# Altium project Power_Control_V6.2.PrjPcb
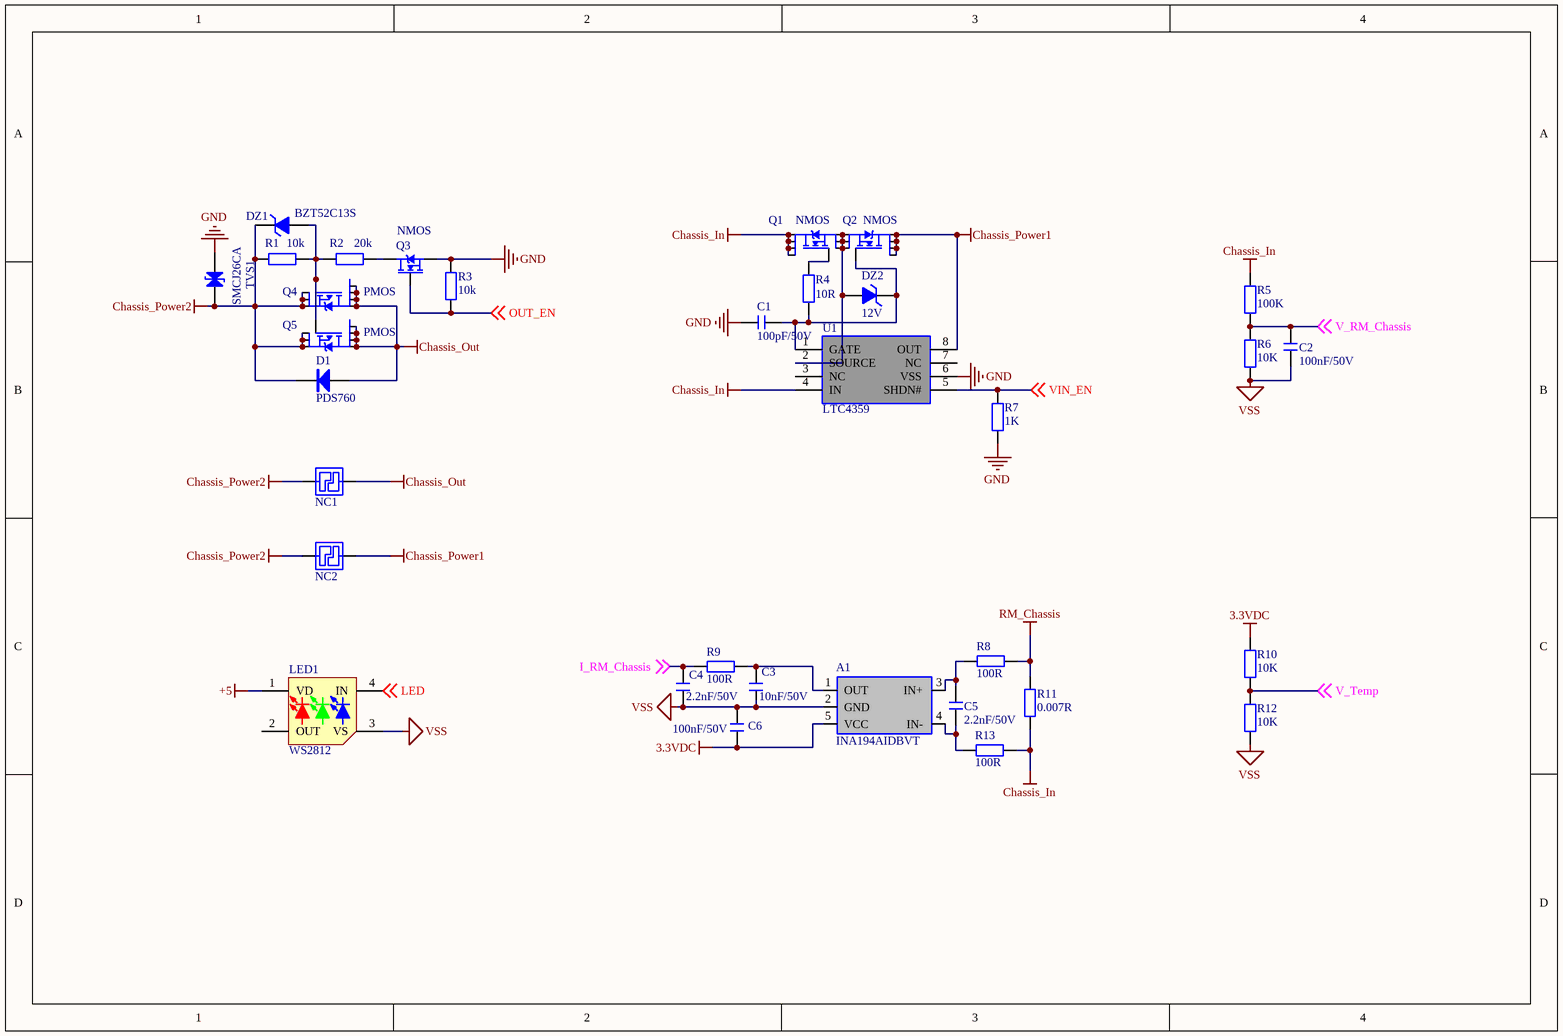
[diagram p0: Function.SchDoc]
5 sheets, 299 parts. Net scope: global (net labels, ports and power ports of the same name join across sheets).
Board file: Power_Control.PcbDoc
Sheets:
  Function.SchDoc
  EDLC_DC_DC.SchDoc
  Port.SchDoc
  Power.SchDoc
  STM32G474R.SchDoc

## Sheet Function.SchDoc
size A4; SheetNumber: 1; SheetTotal: 5

### Parts
(Parts that share a designator on the sheet are numbered #1, #2 ... from top to bottom, then left to right.)
A1  INA194AIDBVT  [SOT23-5]
C1  100pF/50V  [C 0603_L]
C2  100nF/50V  [C 0603_L]
C3  10nF/50V  [C 0603_L]
C4  2.2nF/50V  [C 0603_L]
C5  2.2nF/50V  [C 0603_L]
C6  100nF/50V  [C 0603_L]
D1#1  PDS760  [SMPC]
DZ1  BZT52C13S  [SOD-323]
DZ2  12V  [SOD-323]
LED1  WS2812  [LED 3528-RGB]
NC1  NODE  [NODE-2]  (value not drawn)
NC2  NODE  [NODE-3]  (value not drawn)
Q1  NMOS  [DFN5*6-8L]
Q2  NMOS  [DFN5*6-8L]
Q3  NMOS  [SOT23-3L]
Q4  PMOS  [DFN5*6-8L]
Q5  PMOS  [DFN5*6-8L]
R1  10k  [R 0603_L]
R2  20k  [R 0603_L]
R3  10k  [R 0603_L]
R4  10R  [R 0603_L]
R5  100K  [R 0603_L]
R6  10K  [R 0603_L]
R7  1K  [R 0603_L]
R8  100R  [R 0603_L]
R9  100R  [R 0603_L]
R10  10K  [R 0603_L]
R11  0.007R  [R 2512_M]
R12  10K  [R 0603_L]
R13  100R  [R 0603_L]
TVS1#1  SMCJ26CA  [SMC]
U1  LTC4359  [MSOP8_L]

### Nets
3.3VDC: A1.5(VCC) C6.2 R10.1
+5: LED1.1(VD)
Chassis_In: Q1.5(D) Q1.6(D) Q1.7(D) Q1.8(D) R5.1 R11.2 R13.2 U1.4(IN)
Chassis_Out: D1#1.1(A) NC1.2 Q4.5(D) Q4.6(D) Q4.7(D) Q4.8(D) Q5.5(D) Q5.6(D) Q5.7(D) Q5.8(D)
Chassis_Power1: NC2.2 Q2.5(D) Q2.6(D) Q2.7(D) Q2.8(D) U1.8(OUT)
Chassis_Power2: D1#1.2(K) DZ1.2(K) NC1.1 NC2.1 Q4.1(S) Q4.2(S) Q4.3(S) Q5.1(S) Q5.2(S) Q5.3(S) R1.2 TVS1#1.2(K)
GND: C1.2 Q3.3(S) R3.1 R7.1 TVS1#1.1(A) U1.6(VSS)
RM_Chassis: R8.2 R11.1
VSS: A1.2(GND) C2.1 C3.2 C4.2 C6.1 LED1.3(VS) R6.2 R12.2
I_RM_Chassis: C4.1 R9.2 ; off-sheet I_RM_Chassis  [project net A07_P21]
LED: LED1.4(IN) ; off-sheet LED  [project net B09_P62]
OUT_EN: Q3.1(G) R3.2 ; off-sheet OUT_EN  [project net B11_P33]
V_RM_Chassis: C2.2 R5.2 R6.1 ; off-sheet V_RM_Chassis  [project net A06_P20]
V_Temp: R10.2 R12.1 ; off-sheet V_Temp  [project net B12_P34]
VIN_EN: R7.2 U1.5(SHDN#) ; off-sheet VIN_EN  [project net A15_P51]
NetA1_1: A1.1(OUT) C3.1 R9.1
NetA1_3: A1.3(IN+) C5.1 R8.1
NetA1_4: A1.4(IN-) C5.2 R13.1
NetC1_1: C1.1 DZ2.2(K) Q2.4(G) R4.1 U1.1(GATE)
NetDZ1_1: DZ1.1(A) Q4.4(G) Q5.4(G) R1.1 R2.1
NetDZ2_1: DZ2.1(A) Q1.1(S) Q1.2(S) Q1.3(S) Q2.1(S) Q2.2(S) Q2.3(S) U1.2(SOURCE)
NetQ1_4: Q1.4(G) R4.2
NetQ3_2: Q3.2(D) R2.2

Not connected (* = marked no-connect by the designer): LED1 2(OUT); U1 3(NC) 7(NC)

### Library data of the parts
A1 = INA194AIDBVT: 电流感应放大器 80V
C1-C6 = C: 无极性贴片电容; 版权归属: 源创客; BOM名称: 无极性贴片电容; 学习资源: www.ooocke.com
D1#1 = SS76: 肖特基二极管; 版权归属: 源创客; BOM名称: 肖特基二极管; 学习资源: www.ooocke.com
DZ1 DZ2 = CVD: 稳压二极管
LED1 = WS2812: 全彩可控LED; pin to pad: 1>2 2>1 3>4 4>3
NC1 NC2 = NODE: 大电流节点
Q1 Q2 = NMOS_DFN: DFN封装N沟道场效应管; BOM名称: P沟道场效应管; 版权归属: 源创客; 学习资源: www.ooocke.com
Q3 = NMOS_SS: 贴片信号N沟道场效应管; pin to pad: 2>3 3>2; 版权归属: 源创客; BOM名称: N沟道场效应管; 学习资源: www.ooocke.com
Q4 Q5 = PMOS_DFN: DFN封装P沟道场效应管; 版权归属: 源创客; BOM名称: P沟道场效应管; 学习资源: www.ooocke.com
R1-R9 R11-R13 = R: 贴片电阻; 版权归属: 源创客; BOM名称: 贴片电阻; 学习资源: www.ooocke.com
R10 = R: NTC热敏电阻; BOM名称: 贴片电阻; 版权归属: 源创客; 学习资源: www.ooocke.com
TVS1#1 = TVS: 瞬态电压抑制二极管; 版权归属: 源创客; BOM名称: 瞬态电压抑制二极管; 学习资源: www.ooocke.com
U1 = LTC4359: 理想二极管控制器

## Sheet EDLC_DC_DC.SchDoc
size A3; SheetNumber: 2; SheetTotal: 5
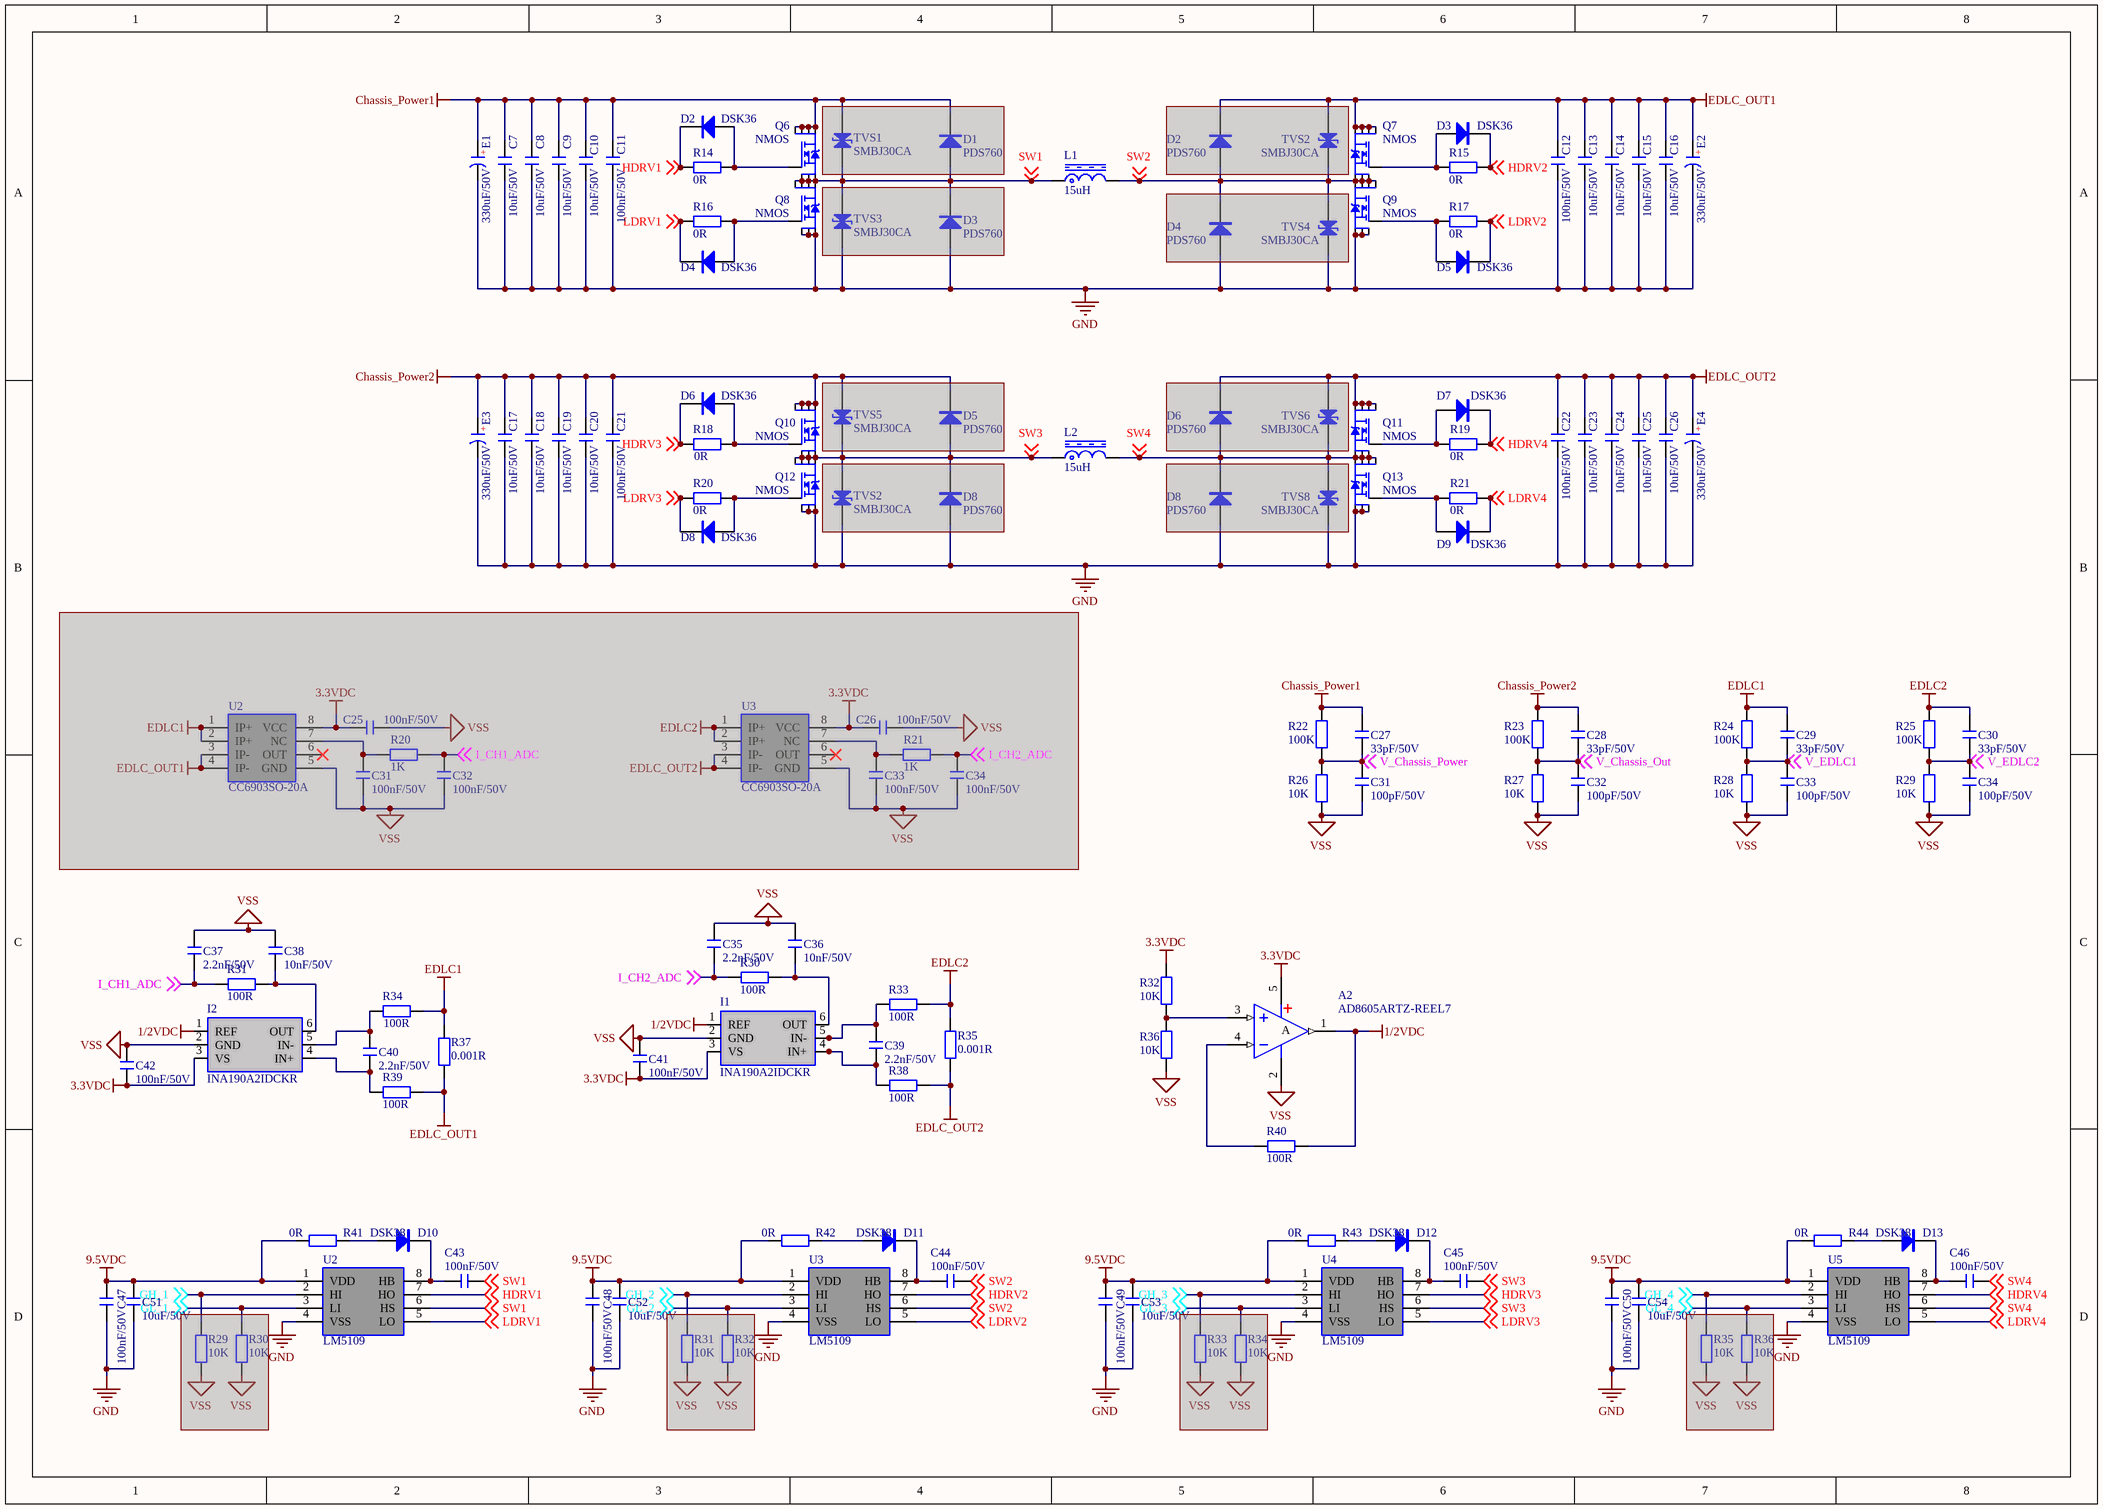
[diagram p1: EDLC_DC_DC.SchDoc]

### Parts
(Parts that share a designator on the sheet are numbered #1, #2 ... from top to bottom, then left to right.)
A2  AD8605ARTZ-REEL7  [SOT23-5N]
C7  10uF/50V  [C 1206_L]
C8  10uF/50V  [C 1206_L]
C9  10uF/50V  [C 1206_L]
C10  10uF/50V  [C 1206_L]
C11  100nF/50V  [C 0603_L]
C12  100nF/50V  [C 0603_L]
C13  10uF/50V  [C 1206_L]
C14  10uF/50V  [C 1206_L]
C15  10uF/50V  [C 1206_L]
C16  10uF/50V  [C 1206_L]
C17  10uF/50V  [C 1206_L]
C18  10uF/50V  [C 1206_L]
C19  10uF/50V  [C 1206_L]
C20  10uF/50V  [C 1206_L]
C21  100nF/50V  [C 0603_L]
C22  100nF/50V  [C 0603_L]
C23  10uF/50V  [C 1206_L]
C24  10uF/50V  [C 1206_L]
C25#1  10uF/50V  [C 1206_L]
C25#2  100nF/50V  [C 0603_L]  (masked out: inside a compile mask, not in the netlist)
C26#1  10uF/50V  [C 1206_L]
C26#2  100nF/50V  [C 0603_L]  (masked out: inside a compile mask, not in the netlist)
C27  33pF/50V  [C 0603_L]
C28  33pF/50V  [C 0603_L]
C29  33pF/50V  [C 0603_L]
C30  33pF/50V  [C 0603_L]
C31#1  100nF/50V  [C 0603_L]  (masked out: inside a compile mask, not in the netlist)
C31#2  100pF/50V  [C 0603_L]
C32#1  100nF/50V  [C 0603_L]  (masked out: inside a compile mask, not in the netlist)
C32#2  100pF/50V  [C 0603_L]
C33#1  100nF/50V  [C 0603_L]  (masked out: inside a compile mask, not in the netlist)
C33#2  100pF/50V  [C 0603_L]
C34#1  100nF/50V  [C 0603_L]  (masked out: inside a compile mask, not in the netlist)
C34#2  100pF/50V  [C 0603_L]
C35  2.2nF/50V  [C 0603_L]
C36  10nF/50V  [C 0603_L]
C37  2.2nF/50V  [C 0603_L]
C38  10nF/50V  [C 0603_L]
C39  2.2nF/50V  [C 0603_L]
C40  2.2nF/50V  [C 0603_L]
C41  100nF/50V  [C 0603_L]
C42  100nF/50V  [C 0603_L]
C43  100nF/50V  [C 0603_L]
C44#1  100nF/50V  [C 0603_L]
C45  100nF/50V  [C 0603_L]
C46  100nF/50V  [C 0603_L]
C47  100nF/50V  [C 0603_L]
C48  100nF/50V  [C 0603_L]
C49  100nF/50V  [C 0603_L]
C50  100nF/50V  [C 0603_L]
C51  10uF/50V  [C 1206_L]
C52  10uF/50V  [C 1206_L]
C53  10uF/50V  [C 1206_L]
C54  10uF/50V  [C 1206_L]
D1#2  PDS760  [SMPC]  (masked out: inside a compile mask, not in the netlist)
D2#1  DSK36  [SOD-323]
D2#2  PDS760  [SMPC]  (masked out: inside a compile mask, not in the netlist)
D3#1  DSK36  [SOD-323]
D3#2  PDS760  [SMPC]  (masked out: inside a compile mask, not in the netlist)
D4#1  PDS760  [SMPC]  (masked out: inside a compile mask, not in the netlist)
D4#2  DSK36  [SOD-323]
D5#1  DSK36  [SOD-323]
D5#2  PDS760  [SMPC]  (masked out: inside a compile mask, not in the netlist)
D6#1  DSK36  [SOD-323]
D6#2  PDS760  [SMPC]  (masked out: inside a compile mask, not in the netlist)
D7  DSK36  [SOD-323]
D8#1  PDS760  [SMPC]  (masked out: inside a compile mask, not in the netlist)
D8#2  PDS760  [SMPC]  (masked out: inside a compile mask, not in the netlist)
D8#3  DSK36  [SOD-323]
D9  DSK36  [SOD-323]
D10  DSK38  [SOD-123F]
D11  DSK38  [SOD-123F]
D12  DSK38  [SOD-123F]
D13  DSK38  [SOD-123F]
E1  330uF/50V  [CS 5.0*10*13 - R]
E2  330uF/50V  [CS 5.0*10*13 - R]
E3  330uF/50V  [CS 5.0*10*13 - R]
E4  330uF/50V  [CS 5.0*10*13 - R]
I1  INA190A2IDCKR  [SC-70-6]
I2  INA190A2IDCKR  [SC-70-6]
L1  15uH  [CKST2020-1717]
L2  15uH  [CKST2020-1717]
Q6  NMOS  [DFN5*6-8L]
Q7  NMOS  [DFN5*6-8L]
Q8  NMOS  [DFN5*6-8L]
Q9  NMOS  [DFN5*6-8L]
Q10  NMOS  [DFN5*6-8L]
Q11  NMOS  [DFN5*6-8L]
Q12  NMOS  [DFN5*6-8L]
Q13  NMOS  [DFN5*6-8L]
R14  0R  [R 0603_L]
R15  0R  [R 0603_L]
R16  0R  [R 0603_L]
R17  0R  [R 0603_L]
R18  0R  [R 0603_L]
R19  0R  [R 0603_L]
R20#1  0R  [R 0603_L]
R20#2  1K  [R 0603_L]  (masked out: inside a compile mask, not in the netlist)
R21#1  0R  [R 0603_L]
R21#2  1K  [R 0603_L]  (masked out: inside a compile mask, not in the netlist)
R22  100K  [R 0603-HP_L]
R23  100K  [R 0603-HP_L]
R24  100K  [R 0603-HP_L]
R25  100K  [R 0603-HP_L]
R26  10K  [R 0603-HP_L]
R27  10K  [R 0603-HP_L]
R28  10K  [R 0603-HP_L]
R29#1  10K  [R 0603-HP_L]
R29#2  10K  [R 0603_L]  (masked out: inside a compile mask, not in the netlist)
R30#1  100R  [R 0603_L]
R30#2  10K  [R 0603_L]  (masked out: inside a compile mask, not in the netlist)
R31#1  100R  [R 0603_L]
R31#2  10K  [R 0603_L]  (masked out: inside a compile mask, not in the netlist)
R32#1  10K  [R 0603-HP_L]
R32#2  10K  [R 0603_L]  (masked out: inside a compile mask, not in the netlist)
R33#1  100R  [R 0603_L]
R33#2  10K  [R 0603_L]  (masked out: inside a compile mask, not in the netlist)
R34#1  100R  [R 0603_L]
R34#2  10K  [R 0603_L]  (masked out: inside a compile mask, not in the netlist)
R35#1  0.001R  [R 2512_M]
R35#2  10K  [R 0603_L]  (masked out: inside a compile mask, not in the netlist)
R36#1  10K  [R 0603-HP_L]
R36#2  10K  [R 0603_L]  (masked out: inside a compile mask, not in the netlist)
R37  0.001R  [R 2512_M]
R38  100R  [R 0603_L]
R39  100R  [R 0603_L]
R40  100R  [R 0603_L]
R41  0R  [R 0603_L]
R42  0R  [R 0603_L]
R43  0R  [R 0603_L]
R44#1  0R  [R 0603_L]
TVS1#2  SMBJ30CA  [SMB]  (masked out: inside a compile mask, not in the netlist)
TVS2#1  SMBJ30CA  [SMB]  (masked out: inside a compile mask, not in the netlist)
TVS2#2  SMBJ30CA  [SMB]  (masked out: inside a compile mask, not in the netlist)
TVS3#1  SMBJ30CA  [SMB]  (masked out: inside a compile mask, not in the netlist)
TVS4#1  SMBJ30CA  [SMB]  (masked out: inside a compile mask, not in the netlist)
TVS5  SMBJ30CA  [SMB]  (masked out: inside a compile mask, not in the netlist)
TVS6  SMBJ30CA  [SMB]  (masked out: inside a compile mask, not in the netlist)
TVS8  SMBJ30CA  [SMB]  (masked out: inside a compile mask, not in the netlist)
U2#1  CC6903SO-20A  [SOP8_L]  (masked out: inside a compile mask, not in the netlist)
U2#2  LM5109  [SOP8_L]
U3#1  CC6903SO-20A  [SOP8_L]  (masked out: inside a compile mask, not in the netlist)
U3#2  LM5109  [SOP8_L]
U4  LM5109  [SOP8_L]
U5  LM5109  [SOP8_L]

### Nets
1/2VDC: A2.1(OUT) I1.1(REF) I2.1(REF) R40.2
3.3VDC: A2.5(V+) C41.2 C42.2 I1.3(VS) I2.3(VS) R32#1.2
9.5VDC: C47.2 C48.2 C49.2 C50.2 C51.2 C52.2 C53.2 C54.2 R41.1 R42.1 R43.1 R44#1.1 U2#2.1(VDD) U3#2.1(VDD) U4.1(VDD) U5.1(VDD)
Chassis_Power1: C7.1 C8.1 C9.1 C10.1 C11.1 C27.1 E1.1(A) Q6.5(D) Q6.6(D) Q6.7(D) Q6.8(D) R22.2
Chassis_Power2: C17.1 C18.1 C19.1 C20.1 C21.1 C28.1 E3.1(A) Q10.5(D) Q10.6(D) Q10.7(D) Q10.8(D) R23.2
EDLC1: C29.1 R24.2 R34#1.2 R37.1
EDLC2: C30.1 R25.2 R33#1.2 R35#1.1
EDLC_OUT1: C12.1 C13.1 C14.1 C15.1 C16.1 E2.1(A) Q7.5(D) Q7.6(D) Q7.7(D) Q7.8(D) R37.2 R39.2
EDLC_OUT2: C22.1 C23.1 C24.1 C25#1.1 C26#1.1 E4.1(A) Q11.5(D) Q11.6(D) Q11.7(D) Q11.8(D) R35#1.2 R38.2
GND: C7.2 C8.2 C9.2 C10.2 C11.2 C12.2 C13.2 C14.2 C15.2 C16.2 C17.2 C18.2 C19.2 C20.2 C21.2 C22.2 C23.2 C24.2 C25#1.2 C26#1.2 C47.1 C48.1 C49.1 C50.1 C51.1 C52.1 C53.1 C54.1 E1.2(K) E2.2(K) E3.2(K) E4.2(K) Q8.1(S) Q8.2(S) Q8.3(S) Q9.1(S) Q9.2(S) Q9.3(S) Q12.1(S) Q12.2(S) Q12.3(S) Q13.1(S) Q13.2(S) Q13.3(S) U2#2.4(VSS) U3#2.4(VSS) U4.4(VSS) U5.4(VSS)
VSS: A2.2(V-) C31#2.2 C32#2.2 C33#2.2 C34#2.2 C35.2 C36.2 C37.2 C38.2 C41.1 C42.1 I1.2(GND) I2.2(GND) R26.1 R27.1 R28.1 R29#1.1 R36#1.1
GH_1: U2#2.2(HI) ; off-sheet GH_1  [project net C09_P41]
GH_2: U3#2.2(HI) ; off-sheet GH_2  [project net A09_P43]
GH_3: U4.2(HI) ; off-sheet GH_3  [project net C07_P39]
GH_4: U5.2(HI) ; off-sheet GH_4  [project net B15_P37]
GL_1: U2#2.3(LI) ; off-sheet GL_1  [project net C08_P40]
GL_2: U3#2.3(LI) ; off-sheet GL_2  [project net A08_P42]
GL_3: U4.3(LI) ; off-sheet GL_3  [project net C06_P38]
GL_4: U5.3(LI) ; off-sheet GL_4  [project net B14_P36]
HDRV1: D2#1.2(K) R14.1 U2#2.7(HO) ; off-sheet HDRV1
HDRV2: D3#1.2(K) R15.2 U3#2.7(HO) ; off-sheet HDRV2
HDRV3: D6#1.2(K) R18.1 U4.7(HO) ; off-sheet HDRV3
HDRV4: D7.2(K) R19.2 U5.7(HO) ; off-sheet HDRV4
I_CH1_ADC: C37.1 R31#1.2 ; off-sheet I_CH1_ADC  [project net B01_P25]
I_CH2_ADC: C35.1 R30#1.2 ; off-sheet I_CH2_ADC  [project net B00_P24]
LDRV1: D4#2.2(K) R16.1 U2#2.5(LO) ; off-sheet LDRV1
LDRV2: D5#1.2(K) R17.2 U3#2.5(LO) ; off-sheet LDRV2
LDRV3: D8#3.2(K) R20#1.1 U4.5(LO) ; off-sheet LDRV3
LDRV4: D9.2(K) R21#1.2 U5.5(LO) ; off-sheet LDRV4
SW1: C43.2 L1.1 Q6.1(S) Q6.2(S) Q6.3(S) Q8.5(D) Q8.6(D) Q8.7(D) Q8.8(D) U2#2.6(HS) ; off-sheet SW1
SW2: C44#1.2 L1.2 Q7.1(S) Q7.2(S) Q7.3(S) Q9.5(D) Q9.6(D) Q9.7(D) Q9.8(D) U3#2.6(HS) ; off-sheet SW2
SW3: C45.2 L2.1 Q10.1(S) Q10.2(S) Q10.3(S) Q12.5(D) Q12.6(D) Q12.7(D) Q12.8(D) U4.6(HS) ; off-sheet SW3
SW4: C46.2 L2.2 Q11.1(S) Q11.2(S) Q11.3(S) Q13.5(D) Q13.6(D) Q13.7(D) Q13.8(D) U5.6(HS) ; off-sheet SW4
V_Chassis_Out: C28.2 C32#2.1 R23.1 R27.2 ; off-sheet V_Chassis_Out  [project net A00_P12]
V_Chassis_Power: C27.2 C31#2.1 R22.1 R26.2 ; off-sheet V_Chassis_Power  [project net C03_P11]
V_EDLC1: C29.2 C33#2.1 R24.1 R28.2 ; off-sheet V_EDLC1  [project net C02_P10]
V_EDLC2: C30.2 C34#2.1 R25.1 R29#1.2 ; off-sheet V_EDLC2  [project net A01_P13]
NetA2_3: A2.3(IN+) R32#1.1 R36#1.2
NetA2_4: A2.4(IN-) R40.1
NetC36_1: C36.1 I1.6(OUT) R30#1.1
NetC38_1: C38.1 I2.6(OUT) R31#1.1
NetC39_1: C39.1 I1.5(IN-) R33#1.1
NetC39_2: C39.2 I1.4(IN+) R38.1
NetC40_1: C40.1 I2.5(IN-) R34#1.1
NetC40_2: C40.2 I2.4(IN+) R39.1
NetC43_1: C43.1 D10.2(K) U2#2.8(HB)
NetC44#1_1: C44#1.1 D11.2(K) U3#2.8(HB)
NetC45_1: C45.1 D12.2(K) U4.8(HB)
NetC46_1: C46.1 D13.2(K) U5.8(HB)
NetD2#1_1: D2#1.1(A) Q6.4(G) R14.2
NetD3#1_1: D3#1.1(A) Q7.4(G) R15.1
NetD4#2_1: D4#2.1(A) Q8.4(G) R16.2
NetD5#1_1: D5#1.1(A) Q9.4(G) R17.1
NetD6#1_1: D6#1.1(A) Q10.4(G) R18.2
NetD7_1: D7.1(A) Q11.4(G) R19.1
NetD8#3_1: D8#3.1(A) Q12.4(G) R20#1.2
NetD9_1: D9.1(A) Q13.4(G) R21#1.1
NetD10_1: D10.1(A) R41.2
NetD11_1: D11.1(A) R42.2
NetD12_1: D12.1(A) R43.2
NetD13_1: D13.1(A) R44#1.2

### Notes on the sheet
- (in symbol AD8605ARTZ-REEL7) A
- (in symbol C-CS) +

### Library data of the parts
A2 = AD8605ARTZ-REEL7: 高精度低噪声CMOS轨对轨输入/输出运算放大器
C7-C24 C25#1 C25#2 C26#1 C26#2 C27-C30 C31#1 C31#2 C32#1 C32#2 C33#1 C33#2 C34#1 C34#2 C35-C43 C44#1 C45-C54 = C: 无极性贴片电容; 版权归属: 源创客; BOM名称: 无极性贴片电容; 学习资源: www.ooocke.com
D1#2 D2#2 D3#2 D4#1 D5#2 D6#2 D8#1 D8#2 = SS76: 肖特基二极管; 版权归属: 源创客; BOM名称: 肖特基二极管; 学习资源: www.ooocke.com
D2#1 D3#1 D4#2 D5#1 D6#1 D7 D8#3 D9 = 1N4148: 高速开关二极管; 版权归属: 源创客; BOM名称: 高速开关二极管; 学习资源: www.ooocke.com
D10-D13 = SS34: 肖特基二极管; 版权归属: 源创客; 属性: 40V/3A; BOM名称: 肖特基二极管; 学习资源: www.ooocke.com
E1-E4 = C-CS: 直插固态电容; 版权归属: 源创客; BOM名称: 直插固态电容; 学习资源: www.ooocke.com
I1 I2 = INA190A2IDCKR: 电流感应放大器 40V
L1 L2 = L-HP: 一体成型电感; BOM名称: 功率屏蔽电感; 版权归属: 源创客; 学习资源: www.ooocke.com
Q6-Q13 = NMOS_DFN: DFN封装N沟道场效应管; BOM名称: P沟道场效应管; 版权归属: 源创客; 学习资源: www.ooocke.com
R14-R19 R20#1 R20#2 R21#1 R21#2 R29#2 R30#1 R30#2 R31#1 R31#2 R32#2 R33#1 R33#2 R34#1 R34#2 R35#1 R35#2 R36#2 R37-R43 R44#1 = R: 贴片电阻; 版权归属: 源创客; BOM名称: 贴片电阻; 学习资源: www.ooocke.com
R22-R28 R29#1 R32#1 R36#1 = R-Precision: 精密贴片电阻; BOM名称: 精密电阻; 版权归属: 源创客; 学习资源: www.ooocke.com
TVS1#2 TVS2#1 TVS2#2 TVS3#1 TVS4#1 TVS5 TVS6 TVS8 = TVS: 瞬态电压抑制二极管; 版权归属: 源创客; BOM名称: 瞬态电压抑制二极管; 学习资源: www.ooocke.com
U2#1 U3#1 = CC6903: 10A/20A/30A霍尔电流传感器
U2#2 U3#2 U4 U5 = LM5109: 半桥驱动

## Sheet Port.SchDoc
size A4; SheetNumber: 3; SheetTotal: 5
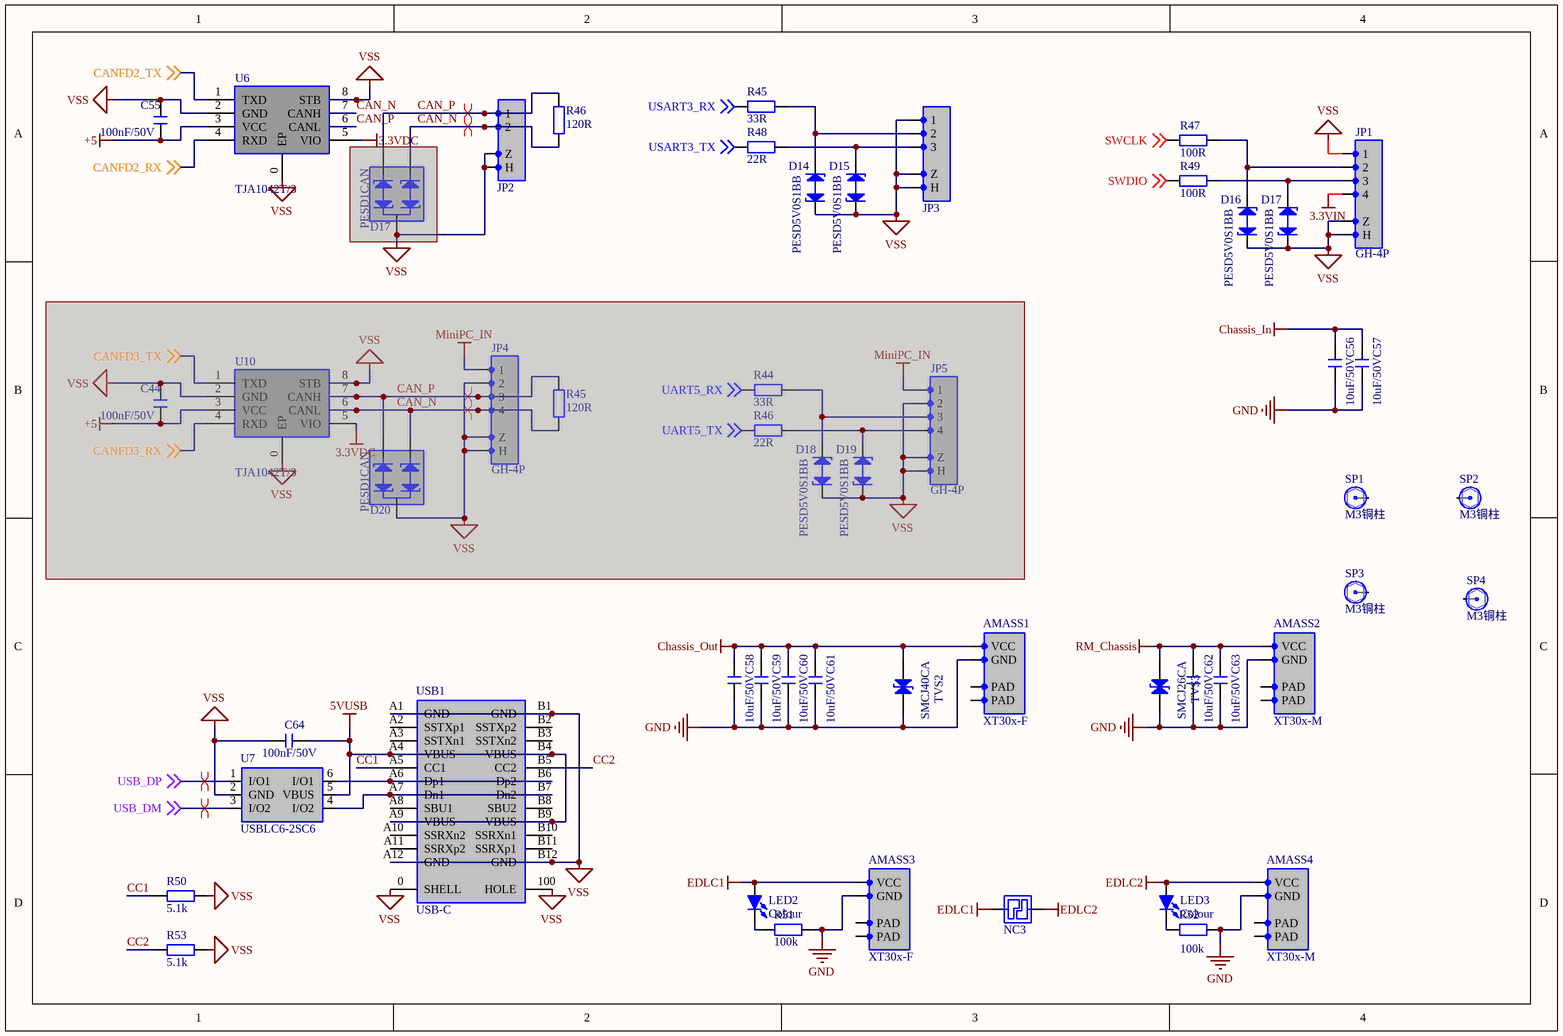
[diagram p2: Port.SchDoc]

### Parts
(Parts that share a designator on the sheet are numbered #1, #2 ... from top to bottom, then left to right.)
AMASS1  XT30x-F  [XT30U-F]
AMASS2  XT30x-M  [XT30U-M]
AMASS3  XT30x-F  [XT30U-F]
AMASS4  XT30x-M  [XT30U-M]
C44#2  100nF/50V  [C 0603_L]  (masked out: inside a compile mask, not in the netlist)
C55  100nF/50V  [C 0603_L]
C56  10uF/50V  [C 1206_L]
C57  10uF/50V  [C 1206_L]
C58  10uF/50V  [C 1206_L]
C59  10uF/50V  [C 1206_L]
C60  10uF/50V  [C 1206_L]
C61  10uF/50V  [C 1206_L]
C62  10uF/50V  [C 1206_L]
C63  10uF/50V  [C 1206_L]
C64  100nF/50V  [C 0603_L]
D14  PESD5V0S1BB  [SOD-523]
D15  PESD5V0S1BB  [SOD-523]
D16  PESD5V0S1BB  [SOD-523]
D17#1  PESD1CAN  [SOT23-3L]  (masked out: inside a compile mask, not in the netlist)
D17#2  PESD5V0S1BB  [SOD-523]
D18  PESD5V0S1BB  [SOD-523]  (masked out: inside a compile mask, not in the netlist)
D19#1  PESD5V0S1BB  [SOD-523]  (masked out: inside a compile mask, not in the netlist)
D20  PESD1CAN  [SOT23-3L]  (masked out: inside a compile mask, not in the netlist)
JP1  GH-4P  [GH 1.25-LS-4P]
JP2  HDR-1X2  [GH 1.25-LS-2P]  (value not drawn)
JP3  HDR-1X3  [GH 1.25-LS-3P]  (value not drawn)
JP4  GH-4P  [GH 1.25-LS-4P]  (masked out: inside a compile mask, not in the netlist)
JP5  GH-4P  [GH 1.25-LS-4P]  (masked out: inside a compile mask, not in the netlist)
LED2  Colour  [LED 0603R]
LED3  Colour  [LED 0603R]
NC3  NODE  [NODE-3]  (value not drawn)
R44#2  33R  [R 0603_L]  (masked out: inside a compile mask, not in the netlist)
R45#1  33R  [R 0603_L]
R45#2  120R  [R 0603_L]  (masked out: inside a compile mask, not in the netlist)
R46#1  120R  [R 0603_L]
R46#2  22R  [R 0603_L]  (masked out: inside a compile mask, not in the netlist)
R47  100R  [R 0603_L]
R48  22R  [R 0603_L]
R49  100R  [R 0603_L]
R50  5.1k  [R 0603_L]
R51  100k  [R 0603_L]
R52  100k  [R 0603_L]
R53  5.1k  [R 0603_L]
SP1  M3铜柱  [M3x4+6_N]
SP2  M3铜柱  [M3x4+6_N]
SP3  M3铜柱  [M3x4+6_N]
SP4  M3铜柱  [M3x4+6_N]
TVS2#3  SMCJ40CA  [SMC]
TVS3#2  SMCJ26CA  [SMC]
U6  TJA1042T/3  [HVSON8_N]
U7  USBLC6-2SC6  [SOT23-6L]
U10  TJA1042T/3  [HVSON8_N]  (masked out: inside a compile mask, not in the netlist)
USB1  USB-C  [USB-C/S_B]

### Nets
3.3VDC: U6.5(VIO)
3.3VIN: JP1.4
5VUSB: C64.1 U7.5(VBUS) USB1.A4(VBUS) USB1.A9(VBUS) USB1.B4(VBUS) USB1.B9(VBUS)
+5: C55.1 U6.3(VCC)
Chassis_In: C56.1 C57.1
Chassis_Out: AMASS1.1(VCC) C58.1 C59.1 C60.1 C61.1 TVS2#3.1(A)
EDLC1: AMASS3.1(VCC) LED2.1(A) NC3.1
EDLC2: AMASS4.1(VCC) LED3.1(A) NC3.2
GND: AMASS1.2(GND) AMASS2.2(GND) AMASS3.2(GND) AMASS4.2(GND) C56.2 C57.2 C58.2 C59.2 C60.2 C61.2 C62.2 C63.2 R51.2 R52.2 TVS2#3.2(K) TVS3#2.2(K)
RM_Chassis: AMASS2.1(VCC) C62.1 C63.1 TVS3#2.1(A)
VSS: C55.2 C64.2 D14.2(K) D15.2(K) D16.2(K) D17#2.2(K) JP1.0(Z) JP1.1 JP1.100(H) JP3.0(Z) JP3.1 JP3.100(H) R50.2 R53.2 U6.0(EP) U6.2(GND) U6.8(STB) U7.2(GND) USB1.0(SHELL) USB1.100(HOLE) USB1.A1(GND) USB1.A12(GND) USB1.B1(GND) USB1.B12(GND)
CAN_N: JP2.2 R46#1.1 U6.7(CANH)
CAN_P: JP2.1 R46#1.2 U6.6(CANL)
CANFD2_RX: U6.4(RXD) ; off-sheet CANFD2_RX  [project net B05_P58]
CANFD2_TX: U6.1(TXD) ; off-sheet CANFD2_TX  [project net B06_P59]
CC1: R50.1 USB1.A5(CC1)
CC2: R53.1 USB1.B5(CC2)
SWCLK: R47.1 ; off-sheet SWCLK  [project net A14_P50]
SWDIO: R49.1 ; off-sheet SWDIO  [project net A13_P49]
USART3_RX: R45#1.1 ; off-sheet USART3_RX  [project net C11_P53]
USART3_TX: R48.1 ; off-sheet USART3_TX  [project net C10_P52]
USB_DM: U7.3(I/O2) ; off-sheet USB_DM  [project net USB_N]
USB_DP: U7.1(I/O1) ; off-sheet USB_DP  [project net USB_P]
NetD14_1: D14.1(A) JP3.2 R45#1.2
NetD15_1: D15.1(A) JP3.3 R48.2
NetD16_1: D16.1(A) JP1.2 R47.2
NetD17#2_1: D17#2.1(A) JP1.3 R49.2
NetJP2_0: JP2.0(Z) JP2.100(H)
NetLED2_2: LED2.2(K) R51.1
NetLED3_2: LED3.2(K) R52.1
NetU7_4: U7.4(I/O2) USB1.A7(Dn1) USB1.B7(Dn2)
NetU7_6: U7.6(I/O1) USB1.A6(Dp1) USB1.B6(Dp2)

Not connected (* = marked no-connect by the designer): AMASS1 0(PAD) 100(PAD); AMASS2 0(PAD) 100(PAD); AMASS3 0(PAD) 100(PAD); AMASS4 0(PAD) 100(PAD); SP1 1; SP2 1; SP3 1; SP4 1; USB1 A2(SSTXp1) A3(SSTXn1) A8(SBU1) A10(SSRXn2) A11(SSRXp2) B2(SSTXp2) B3(SSTXn2) B8(SBU2) B10(SSRXn1) B11(SSRXp1)

### Layout directives
differential pair: (no net found under the mark), CAN_N, CAN_P, USB_N, USB_P

### Library data of the parts
AMASS1-AMASS4 = XT30: Amass防打火电源接口，XT30系列
C44#2 C55-C64 = C: 无极性贴片电容; 版权归属: 源创客; BOM名称: 无极性贴片电容; 学习资源: www.ooocke.com
D14-D16 D17#2 D18 D19#1 = ESD: 双向静电放电二极管
D17#1 D20 = ESD_2P: CAN总线双向静电放电二极管
JP1 JP4 JP5 = Header 4: 4P接插件; 版权归属: 源创客; BOM名称: 4P接插件; 学习资源: www.ooocke.com
JP2 = Header 2: 2P接插件; 版权归属: 源创客; BOM名称: 2P接插件; 学习资源: www.ooocke.com
JP3 = Header 3: 3P接插件; 版权归属: 源创客; BOM名称: 3P接插件; 学习资源: www.ooocke.com
LED2 LED3 = LED-SMD: 贴片LED; 版权归属: 源创客; BOM名称: 贴片LED; 学习资源: www.ooocke.com
NC3 = NODE: 大电流节点
R44#2 R45#1 R45#2 R46#1 R46#2 R47-R53 = R: 贴片电阻; 版权归属: 源创客; BOM名称: 贴片电阻; 学习资源: www.ooocke.com
SP1-SP4 = 铜柱加头大焊盘: 铜柱; 版权归属: 源创客; BOM名称: 铜柱; 学习资源: www.ooocke.com
TVS2#3 TVS3#2 = TVS: 瞬态电压抑制二极管; 版权归属: 源创客; BOM名称: 瞬态电压抑制二极管; 学习资源: www.ooocke.com
U6 U10 = TJA1042T/3: CAN-FD收发器
U7 = USBLC6-2SC6: USBESD保护器TVS陈列; 版权归属: 源创客; 学习资源: www.ooocke.com
USB1 = USB-C/S: USB-C型母接口; 版权归属: 源创客; BOM名称: USB-C型母接口; 学习资源: www.ooocke.com

## Sheet Power.SchDoc
size A4; SheetNumber: 4; SheetTotal: 5
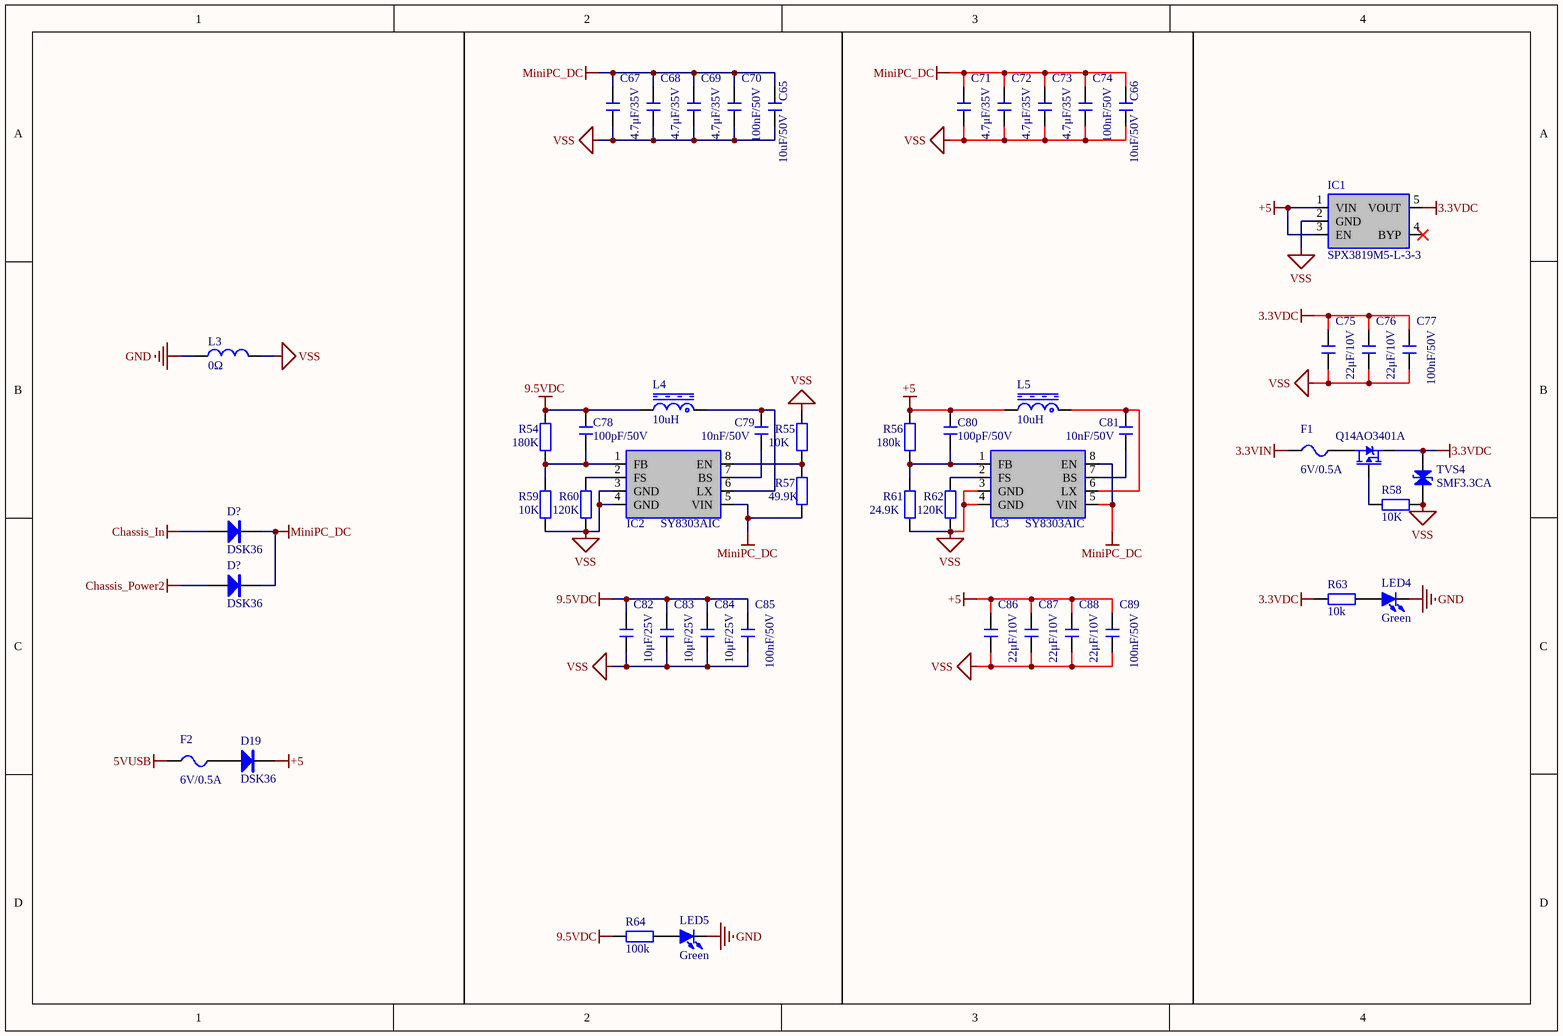
[diagram p3: Power.SchDoc]

### Parts
(Parts that share a designator on the sheet are numbered #1, #2 ... from top to bottom, then left to right.)
C65  10uF/50V  [C 1206_L]
C66  10uF/50V  [C 0805_M]
C67  4.7μF/35V  [C 0603_L]
C68  4.7μF/35V  [C 0603_L]
C69  4.7μF/35V  [C 0603_L]
C70  100nF/50V  [C 0603_L]
C71  4.7μF/35V  [C 0603_L]
C72  4.7μF/35V  [C 0603_L]
C73  4.7μF/35V  [C 0603_L]
C74  100nF/50V  [C 0603_L]
C75  22μF/10V  [C 0603_L]
C76  22μF/10V  [C 0603_L]
C77  100nF/50V  [C 0603_L]
C78  100pF/50V  [C 0603_L]
C79  10nF/50V  [C 0603_L]
C80  100pF/50V  [C 0603_L]
C81  10nF/50V  [C 0603_L]
C82  10μF/25V  [C 0603_L]
C83  10μF/25V  [C 0603_L]
C84  10μF/25V  [C 0603_L]
C85  100nF/50V  [C 0603_L]
C86  22μF/10V  [C 0603_L]
C87  22μF/10V  [C 0603_L]
C88  22μF/10V  [C 0603_L]
C89  100nF/50V  [C 0603_L]
D19#2  DSK36  [SOD-123F]
D?#1  DSK36  [SOD-123F]
D?#2  DSK36  [SOD-123F]
F1  6V/0.5A  [FU 0603]
F2  6V/0.5A  [FU 0603]
IC1  SPX3819M5-L-3-3  [SOT23-5L]
IC2  SY8303AIC  [SOT23-8L]
IC3  SY8303AIC  [SOT23-8L]
L3  0Ω  [L 0603]
L4  10uH  [CKST0502]
L5  10uH  [CKST0502]
LED4  Green  [LED 0603Y]
LED5  Green  [LED 0603Y]
Q14  AO3401A  [SOT23-3L]
R54  180K  [R 0603-HP_L]
R55  10K  [R 0603_L]
R56  180k  [R 0603-HP_L]
R57  49.9K  [R 0603_L]
R58  10K  [R 0603_L]
R59  10K  [R 0603-HP_L]
R60  120K  [R 0603_L]
R61  24.9K  [R 0603-HP_L]
R62  120K  [R 0603_L]
R63  10k  [R 0603_L]
R64  100k  [R 0603_L]
TVS4#2  SMF3.3CA  [SOD-123F]

### Nets
3.3VDC: C75.1 C76.1 C77.2 IC1.5(VOUT) Q14.3(S) R63.1 TVS4#2.1(A)
3.3VIN: F1.1
5VUSB: F2.1
9.5VDC: C78.2 C82.1 C83.1 C84.1 C85.2 L4.2 R54.1 R64.1
+5: C80.2 C86.1 C87.1 C88.1 C89.2 D19#2.2(K) IC1.1(VIN) IC1.3(EN) L5.2 R56.1
Chassis_In: D?#1.1(A)
Chassis_Power2: D?#2.1(A)
GND: L3.1 LED4.2(K) LED5.2(K)
MiniPC_DC: C65.1 C66.1 C67.1 C68.1 C69.1 C70.2 C71.1 C72.1 C73.1 C74.2 D?#1.2(K) D?#2.2(K) IC2.5(VIN) IC3.5(VIN) IC3.8(EN) R57.1
VSS: C65.2 C66.2 C67.2 C68.2 C69.2 C70.1 C71.2 C72.2 C73.2 C74.1 C75.2 C76.2 C77.1 C82.2 C83.2 C84.2 C85.1 C86.2 C87.2 C88.2 C89.1 IC1.2(GND) IC2.3(GND) IC2.4(GND) IC3.3(GND) IC3.4(GND) L3.2 R55.2 R58.2 R59.1 R60.1 R61.1 R62.1 TVS4#2.2(K)
NetC78_1: C78.1 IC2.1(FB) R54.2 R59.2
NetC79_1: C79.1 IC2.6(LX) L4.1
NetC79_2: C79.2 IC2.7(BS)
NetC80_1: C80.1 IC3.1(FB) R56.2 R61.2
NetC81_1: C81.1 IC3.6(LX) L5.1
NetC81_2: C81.2 IC3.7(BS)
NetD19#2_1: D19#2.1(A) F2.2
NetF1_2: F1.2 Q14.2(D)
NetIC2_2: IC2.2(FS) R60.2
NetIC2_8: IC2.8(EN) R55.1 R57.2
NetIC3_2: IC3.2(FS) R62.2
NetLED4_1: LED4.1(A) R63.2
NetLED5_1: LED5.1(A) R64.2
NetQ14_1: Q14.1(G) R58.1

Not connected (* = marked no-connect by the designer): IC1 4(BYP)*

### Library data of the parts
C65-C89 = C: 无极性贴片电容; 版权归属: 源创客; BOM名称: 无极性贴片电容; 学习资源: www.ooocke.com
D19#2 D?#1 D?#2 = SS34: 肖特基二极管; 版权归属: 源创客; 属性: 40V/3A; BOM名称: 肖特基二极管; 学习资源: www.ooocke.com
F1 F2 = FU: 贴片保险丝; 版权归属: 源创客; BOM名称: 贴片保险丝; 学习资源: www.ooocke.com
IC1 = SPX3819: LDO线性稳压芯片
IC2 IC3 = SY8303: DC降压芯片; 版权归属: 源创客; 学习资源: www.ooocke.com
L3 = L: 小功率贴片电感; 版权归属: 源创客; BOM名称: 小功率贴片电感; 学习资源: www.ooocke.com
L4 L5 = L-HP: 一体成型电感; BOM名称: 功率屏蔽电感; 版权归属: 源创客; 学习资源: www.ooocke.com
LED4 LED5 = LED-SMD: 贴片LED; 版权归属: 源创客; BOM名称: 贴片LED; 学习资源: www.ooocke.com
Q14 = PMOS_SS: 贴片信号P沟道场效应管; pin to pad: 2>3 3>2; 版权归属: 源创客; BOM名称: P沟道场效应管; 学习资源: www.ooocke.com
R54 R56 R59 R61 = R-Precision: 精密贴片电阻; BOM名称: 精密电阻; 版权归属: 源创客; 学习资源: www.ooocke.com
R55 R57 R58 R60 R62-R64 = R: 贴片电阻; 版权归属: 源创客; BOM名称: 贴片电阻; 学习资源: www.ooocke.com
TVS4#2 = TVS: 瞬态电压抑制二极管; 版权归属: 源创客; BOM名称: 瞬态电压抑制二极管; 学习资源: www.ooocke.com

## Sheet STM32G474R.SchDoc
size B; SheetNumber: 5; SheetTotal: 5
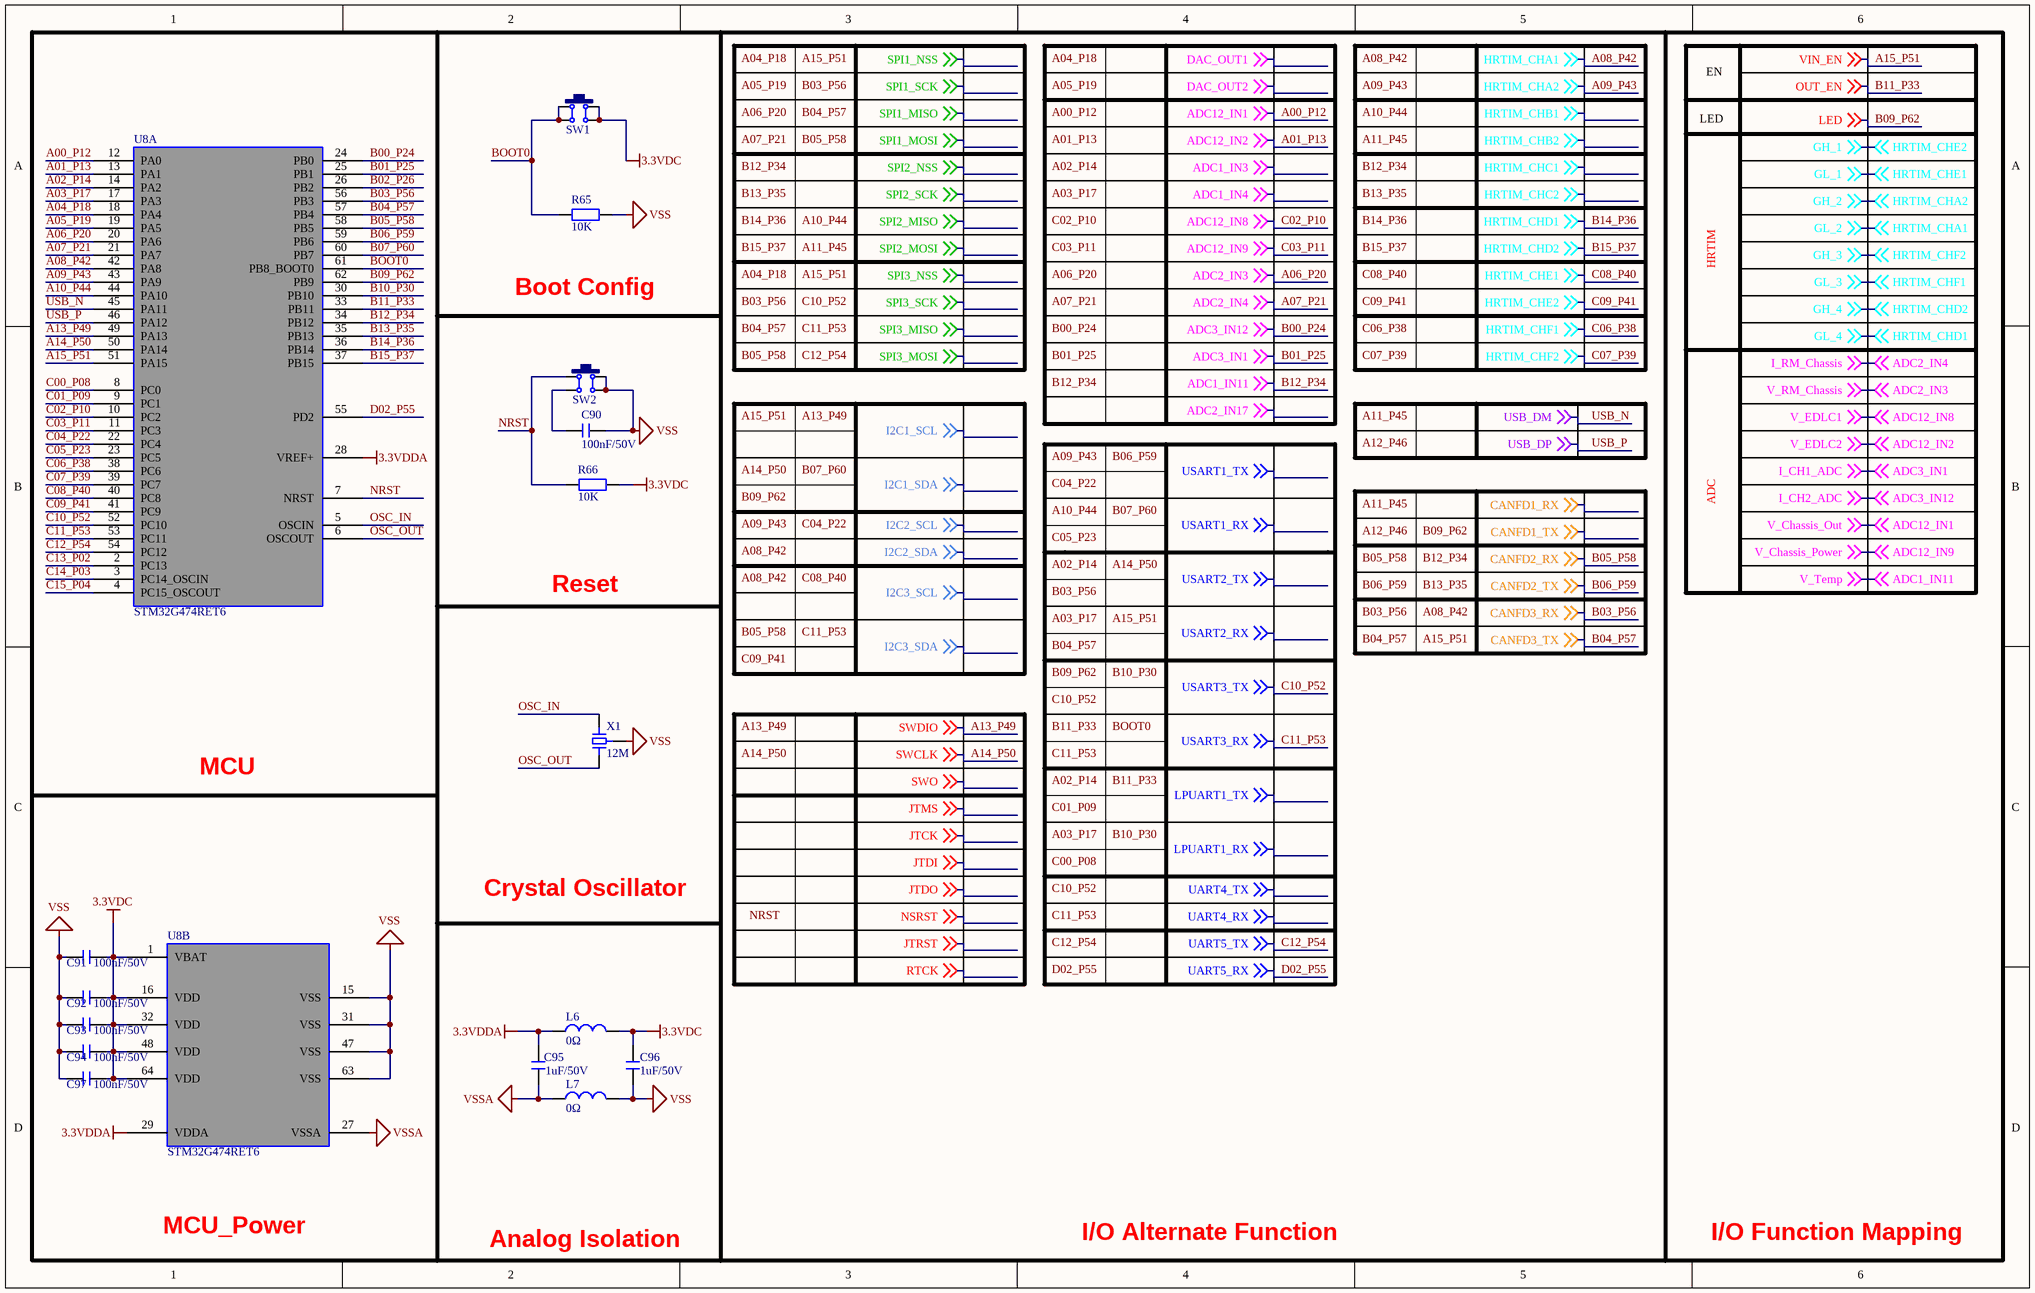
[diagram p4: STM32G474R.SchDoc]

### Parts
C90  100nF/50V  [C 0603_L]
C91  100nF/50V  [C 0603_L]
C92  100nF/50V  [C 0603_L]
C93  100nF/50V  [C 0603_L]
C94  100nF/50V  [C 0603_L]
C95  1uF/50V  [C 0603_L]
C96  1uF/50V  [C 0603_L]
C97  100nF/50V  [C 0603_L]
L6  0Ω  [L 0603]
L7  0Ω  [L 0603]
R65  10K  [R 0603_L]
R66  10K  [R 0603_L]
SW1  3.2x4.2x2.5  [TSW SMD-3.2*4.2*2.5]  (value not drawn)
SW2  3.2x4.2x2.5  [TSW SMD-3.2*4.2*2.5]  (value not drawn)
U8  STM32G474RET6  [LQFP64-10*10]  (parts A,B of 2)
X1  12M  [OSC 3213-3P]

### Nets
3.3VDC: C91.2 C92.2 C93.2 C94.2 C96.2 C97.2 L6.2 R66.1 SW1.1 SW1.4 U8.1(VBAT) U8.16(VDD) U8.32(VDD) U8.48(VDD) U8.64(VDD)
3.3VDDA: C95.2 L6.1 U8.28(VREF+) U8.29(VDDA)
VSS: C90.2 C91.1 C92.1 C93.1 C94.1 C96.1 C97.1 L7.2 R65.1 SW2.1 SW2.4 U8.15(VSS) U8.31(VSS) U8.47(VSS) U8.63(VSS) X1.3
VSSA: C95.1 L7.1 U8.27(VSSA)
A00_P12: U8.12(PA0) ; off-sheet ADC12_IN1, off-sheet V_Chassis_Out  [also labelled ADC12_IN1, V_Chassis_Out]
A01_P13: U8.13(PA1) ; off-sheet ADC12_IN2, off-sheet V_EDLC2  [also labelled ADC12_IN2, V_EDLC2]
A02_P14: U8.14(PA2)
A03_P17: U8.17(PA3)
A04_P18: U8.18(PA4)
A05_P19: U8.19(PA5)
A06_P20: U8.20(PA6) ; off-sheet ADC2_IN3, off-sheet V_RM_Chassis  [also labelled ADC2_IN3, V_RM_Chassis]
A07_P21: U8.21(PA7) ; off-sheet ADC2_IN4, off-sheet I_RM_Chassis  [also labelled ADC2_IN4, I_RM_Chassis]
A08_P42: U8.42(PA8) ; off-sheet HRTIM_CHA1, off-sheet GL_2  [also labelled GL_2, HRTIM_CHA1]
A09_P43: U8.43(PA9) ; off-sheet HRTIM_CHA2, off-sheet GH_2  [also labelled GH_2, HRTIM_CHA2]
A10_P44: U8.44(PA10)
A13_P49: U8.49(PA13) ; off-sheet SWDIO  [also labelled SWDIO]
A14_P50: U8.50(PA14) ; off-sheet SWCLK  [also labelled SWCLK]
A15_P51: U8.51(PA15) ; off-sheet VIN_EN  [also labelled VIN_EN]
B00_P24: U8.24(PB0) ; off-sheet ADC3_IN12, off-sheet I_CH2_ADC  [also labelled ADC3_IN12, I_CH2_ADC]
B01_P25: U8.25(PB1) ; off-sheet ADC3_IN1, off-sheet I_CH1_ADC  [also labelled ADC3_IN1, I_CH1_ADC]
B02_P26: U8.26(PB2)
B03_P56: U8.56(PB3) ; off-sheet CANFD3_RX  [also labelled CANFD3_RX]
B04_P57: U8.57(PB4) ; off-sheet CANFD3_TX  [also labelled CANFD3_TX]
B05_P58: U8.58(PB5) ; off-sheet CANFD2_RX  [also labelled CANFD2_RX]
B06_P59: U8.59(PB6) ; off-sheet CANFD2_TX  [also labelled CANFD2_TX]
B07_P60: U8.60(PB7)
B09_P62: U8.62(PB9) ; off-sheet LED  [also labelled LED]
B10_P30: U8.30(PB10)
B11_P33: U8.33(PB11) ; off-sheet OUT_EN  [also labelled OUT_EN]
B12_P34: U8.34(PB12) ; off-sheet ADC1_IN11, off-sheet V_Temp  [also labelled ADC1_IN11, V_Temp]
B13_P35: U8.35(PB13)
B14_P36: U8.36(PB14) ; off-sheet HRTIM_CHD1, off-sheet GL_4  [also labelled GL_4, HRTIM_CHD1]
B15_P37: U8.37(PB15) ; off-sheet HRTIM_CHD2, off-sheet GH_4  [also labelled GH_4, HRTIM_CHD2]
BOOT0: R65.2 SW1.2 SW1.3 U8.61(PB8_BOOT0)
C00_P08: U8.8(PC0)
C01_P09: U8.9(PC1)
C02_P10: U8.10(PC2) ; off-sheet ADC12_IN8, off-sheet V_EDLC1  [also labelled ADC12_IN8, V_EDLC1]
C03_P11: U8.11(PC3) ; off-sheet ADC12_IN9, off-sheet V_Chassis_Power  [also labelled ADC12_IN9, V_Chassis_Power]
C04_P22: U8.22(PC4)
C05_P23: U8.23(PC5)
C06_P38: U8.38(PC6) ; off-sheet HRTIM_CHF1, off-sheet GL_3  [also labelled GL_3, HRTIM_CHF1]
C07_P39: U8.39(PC7) ; off-sheet HRTIM_CHF2, off-sheet GH_3  [also labelled GH_3, HRTIM_CHF2]
C08_P40: U8.40(PC8) ; off-sheet HRTIM_CHE1, off-sheet GL_1  [also labelled GL_1, HRTIM_CHE1]
C09_P41: U8.41(PC9) ; off-sheet HRTIM_CHE2, off-sheet GH_1  [also labelled GH_1, HRTIM_CHE2]
C10_P52: U8.52(PC10) ; off-sheet USART3_TX  [also labelled USART3_TX]
C11_P53: U8.53(PC11) ; off-sheet USART3_RX  [also labelled USART3_RX]
C12_P54: U8.54(PC12) ; off-sheet UART5_TX  [also labelled UART5_TX]
C13_P02: U8.2(PC13)
C14_P03: U8.3(PC14_OSCIN)
C15_P04: U8.4(PC15_OSCOUT)
D02_P55: U8.55(PD2) ; off-sheet UART5_RX  [also labelled UART5_RX]
NRST: R66.2 SW2.2 U8.7(NRST)
OSC_IN: U8.5(OSCIN) X1.2
OSC_OUT: U8.6(OSCOUT) X1.1
USB_N: U8.45(PA11) ; off-sheet USB_DM  [also labelled USB_DM]
USB_P: U8.46(PA12) ; off-sheet USB_DP  [also labelled USB_DP]
NetC90_1: C90.1 SW2.3

### Notes on the sheet
- EN
- LED
- Boot Config
- HRTIM
- ADC
- Reset
- MCU
- Crystal Oscillator
- MCU_Power
- I/O Alternate Function
- I/O Function Mapping
- Analog Isolation
- Labels drawn without touching a wire or pin: A00_P12, A01_P13, A02_P14, A03_P17, A04_P18, A05_P19, A06_P20, A07_P21, A08_P42, A09_P43, A10_P44, A11_P45, A12_P46, A13_P49, A14_P50, A15_P51, B00_P24, B01_P25, B03_P56, B04_P57, B05_P58, B06_P59, B07_P60, B09_P62, B10_P30, B11_P33, B12_P34, B13_P35, B14_P36, B15_P37, BOOT0, C00_P08, C01_P09, C02_P10, C03_P11, C04_P22, C05_P23, C06_P38, C07_P39, C08_P40, C09_P41, C10_P52, C11_P53, C12_P54, D02_P55, NRST

### Library data of the parts
C90-C97 = C: 无极性贴片电容; 版权归属: 源创客; BOM名称: 无极性贴片电容; 学习资源: www.ooocke.com
L6 L7 = L: 小功率贴片电感; 版权归属: 源创客; BOM名称: 小功率贴片电感; 学习资源: www.ooocke.com
R65 R66 = R: 贴片电阻; 版权归属: 源创客; BOM名称: 贴片电阻; 学习资源: www.ooocke.com
SW1 SW2 = TSW SMD-3x4_D: 3.2x4.2轻触开关; BOM名称: 3x6轻触开关; 版权归属: 源创客; 学习资源: www.ooocke.com
X1 = XTAL-3P: 3脚内置电容无源晶振

## Nets that join several sheets
3.3VDC: Function (A1.5 C6.2 R10.1), EDLC_DC_DC (6 pins), Port (U6.5), Power (7 pins), STM32G474R (15 pins)
3.3VIN: Port (JP1.4), Power (F1.1)
5VUSB: Port (6 pins), Power (F2.1)
9.5VDC: EDLC_DC_DC (16 pins), Power (8 pins)
+5: Function (LED1.1), Port (C55.1 U6.3), Power (10 pins)
Chassis_In: Function (8 pins), Port (C56.1 C57.1), Power (D?#1.1)
Chassis_Out: Function (10 pins), Port (6 pins)
Chassis_Power1: Function (6 pins), EDLC_DC_DC (12 pins)
Chassis_Power2: Function (12 pins), EDLC_DC_DC (12 pins), Power (D?#2.1)
EDLC1: EDLC_DC_DC (C29.1 R24.2 R34#1.2 R37.1), Port (AMASS3.1 LED2.1 NC3.1)
EDLC2: EDLC_DC_DC (C30.1 R25.2 R33#1.2 R35#1.1), Port (AMASS4.1 LED3.1 NC3.2)
GND: Function (6 pins), EDLC_DC_DC (48 pins), Port (16 pins), Power (L3.1 LED4.2 LED5.2)
RM_Chassis: Function (R8.2 R11.1), Port (AMASS2.1 C62.1 C63.1 TVS3#2.1)
VSS: Function (8 pins), EDLC_DC_DC (18 pins), Port (24 pins), Power (34 pins), STM32G474R (16 pins)
A00_P12: EDLC_DC_DC (C28.2 C32#2.1 R23.1 R27.2), STM32G474R (U8.12)
A01_P13: EDLC_DC_DC (C30.2 C34#2.1 R25.1 R29#1.2), STM32G474R (U8.13)
A06_P20: Function (C2.2 R5.2 R6.1), STM32G474R (U8.20)
A07_P21: Function (C4.1 R9.2), STM32G474R (U8.21)
A08_P42: EDLC_DC_DC (U3#2.3), STM32G474R (U8.42)
A09_P43: EDLC_DC_DC (U3#2.2), STM32G474R (U8.43)
A13_P49: Port (R49.1), STM32G474R (U8.49)
A14_P50: Port (R47.1), STM32G474R (U8.50)
A15_P51: Function (R7.2 U1.5), STM32G474R (U8.51)
B00_P24: EDLC_DC_DC (C35.1 R30#1.2), STM32G474R (U8.24)
B01_P25: EDLC_DC_DC (C37.1 R31#1.2), STM32G474R (U8.25)
B05_P58: Port (U6.4), STM32G474R (U8.58)
B06_P59: Port (U6.1), STM32G474R (U8.59)
B09_P62: Function (LED1.4), STM32G474R (U8.62)
B11_P33: Function (Q3.1 R3.2), STM32G474R (U8.33)
B12_P34: Function (R10.2 R12.1), STM32G474R (U8.34)
B14_P36: EDLC_DC_DC (U5.3), STM32G474R (U8.36)
B15_P37: EDLC_DC_DC (U5.2), STM32G474R (U8.37)
C02_P10: EDLC_DC_DC (C29.2 C33#2.1 R24.1 R28.2), STM32G474R (U8.10)
C03_P11: EDLC_DC_DC (C27.2 C31#2.1 R22.1 R26.2), STM32G474R (U8.11)
C06_P38: EDLC_DC_DC (U4.3), STM32G474R (U8.38)
C07_P39: EDLC_DC_DC (U4.2), STM32G474R (U8.39)
C08_P40: EDLC_DC_DC (U2#2.3), STM32G474R (U8.40)
C09_P41: EDLC_DC_DC (U2#2.2), STM32G474R (U8.41)
C10_P52: Port (R48.1), STM32G474R (U8.52)
C11_P53: Port (R45#1.1), STM32G474R (U8.53)
USB_N: Port (U7.3), STM32G474R (U8.45)
USB_P: Port (U7.1), STM32G474R (U8.46)